# EAGLE design TranslatorETH (EAGLE 7.6.0)
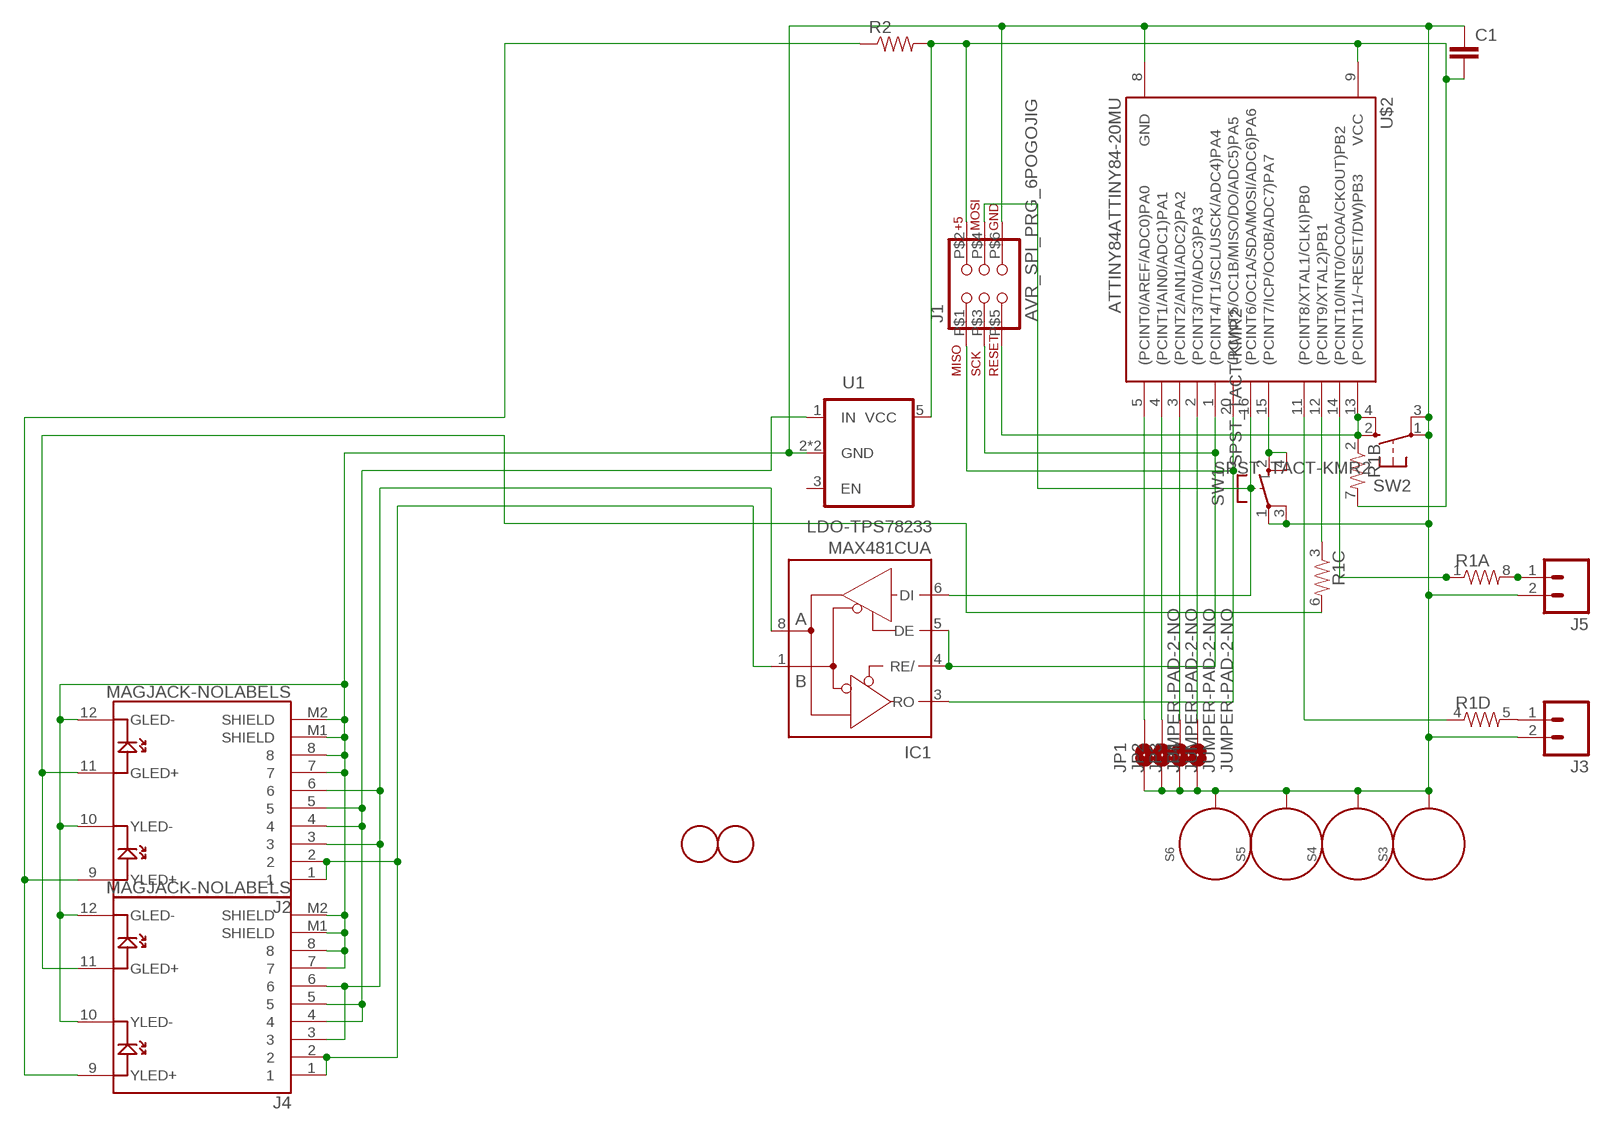
[diagram p0: schematic, sheet 1]

## Parts
C1  CAP0805  [0805]
IC1  MAX481CUA  [UMAX8]
J1  AVR_SPI_PRG_6POGOJIG  [2X3_MAX]
J2  MAGJACK-NOLABELS  [MAGJACK]
J3  M025MM  [SCREWTERMINAL-5MM-2]
J4  MAGJACK-NOLABELS  [MAGJACK]
J5  M025MM  [SCREWTERMINAL-5MM-2]
JP1  JUMPER-PAD-2-NO  [PAD-JUMPER-2-NO_NO_SILK]
JP2  JUMPER-PAD-2-NO  [PAD-JUMPER-2-NO_NO_SILK]
JP3  JUMPER-PAD-2-NO  [PAD-JUMPER-2-NO_NO_SILK]
JP4  JUMPER-PAD-2-NO  [PAD-JUMPER-2-NO_NO_SILK]
R1  RESISTOR-ARRAY0603-ARV  [0603-ARV]
R2  RESISTOR0805-RES  [0805]
S3  STANDOFF_ELECTRICAL  [STANDOFF-ELECTRICAL]
S4  STANDOFF_ELECTRICAL  [STANDOFF-ELECTRICAL]
S5  STANDOFF_ELECTRICAL  [STANDOFF-ELECTRICAL]
S6  STANDOFF_ELECTRICAL  [STANDOFF-ELECTRICAL]
SW1  SPST_TACT-KMR2  [KMR2]
SW2  SPST_TACT-KMR2  [KMR2]
U1  LDO-TPS78233  [SOT23-5]
U$2  ATTINY84ATTINY84-20MU  [QFN20]
U$3  FIDUCIAL  [FIDUCIAL_1MM]
U$4  FIDUCIAL  [FIDUCIAL_1MM]

## Nets
485A: IC1.8(A) J2.3 J2.6 J4.3 J4.6
485B: IC1.1(B) J2.1 J2.2 J4.1 J4.2
FLOW: IC1.4(RE/) IC1.5(DE) J1.P$3(SCK) U$2.1((PCINT4/T1/SCL/USCK/ADC4)PA4)
GND: C1.1 J1.P$6(GND) J2.7 J2.8 J2.10(YLED-) J2.12(GLED-) J2.M1(SHIELD) J2.M2(SHIELD) J3.2 J4.7 J4.8 J4.10(YLED-) J4.12(GLED-) J4.M1(SHIELD) J4.M2(SHIELD) J5.2 JP1.1 JP2.1 JP3.1 JP4.1 S3.P1 S4.P1 S5.P1 S6.P1 SW1.1(P) SW1.3(P1) SW2.1(P) SW2.3(P1) U1.2(GND) U1.4(GND) U$2.8(GND)
N$1: JP1.2 U$2.5((PCINT0/AREF/ADC0)PA0)
N$2: R1.3 U$2.12((PCINT9/XTAL2)PB1)
N$3: J3.1 R1.5
N$4: JP2.2 U$2.4((PCINT1/AIN0/ADC1)PA1)
N$5: J5.1 R1.8
N$6: JP3.2 U$2.3((PCINT2/AIN1/ADC2)PA2)
N$7: JP4.2 U$2.2((PCINT3/T0/ADC3)PA3)
N$9: SW1.2(S) SW1.4(S1) U$2.15((PCINT7/ICP/OC0B/ADC7)PA7)
N$13: J2.11(GLED+) J4.11(GLED+) R1.6
N$14: J2.9(YLED+) J4.9(YLED+) R2.1
N$15: J2.4 J2.5 J4.4 J4.5 U1.1(IN)
OUT1: R1.1 U$2.14((PCINT10/INT0/OC0A/CKOUT)PB2)
OUT3: R1.4 U$2.11((PCINT8/XTAL1/CLKI)PB0)
RST: J1.P$5(RESET) R1.2 SW2.2(S) SW2.4(S1) U$2.13((PCINT11/~RESET/DW)PB3)
RX: IC1.3(RO) J1.P$1(MISO) U$2.20((PCINT5/OC1B/MISO/DO/ADC5)PA5)
TX: IC1.6(DI) J1.P$4(MOSI) U$2.16((PCINT6/OC1A/SDA/MOSI/ADC6)PA6)
VCC: C1.2 J1.P$2(VIN) R1.7 R2.2 U1.5(VCC) U$2.9(VCC)
Unconnected: U1.3(EN)

## Power pins joined to a net without a drawn wire
GND: IC1.7(GND)
VCC: IC1.2(VCC)

## Library data of the parts
C1 = SparkFun-Capacitors:CAP: Capacitor Standard 0603 ceramic capacitor, and 0.1" leaded capacitor.
IC1 = maxim:MAX481CUA: RS485 TRANSEIVER; MPN: MAX481CUA+; OC_FARNELL: unknown; OC_NEWARK: 71P2381
J1 = SparkFun-Connectors:AVR_SPI_PRG_6: AVR ISP 6 Pin This is the reduced ISP connector for AVR programming. Common on Arduino. This footprint will take up less PCB space and can be used with a 10-pin to 6-pin adapter such as SKU: BOB-08508 **Special note about "TEST_POINT" package. The stop mask is on the top side, so if you want your programming test points to be on the bottom of your board, make sure to place this package on the bottom side of the board. This also ensure that the orientation to program from the bottom side will be correct.
J2 J4 = SparkFun-Connectors:MAGJACK-NOLABELS; PROD_ID: CONN-09556
J3 J5 = SparkFun-Connectors:M02: Standard 2-pin 0.1" header. Use with - straight break away headers ( PRT-00116) - right angle break away headers (PRT-00553) - swiss pins (PRT-00743) - machine pins (PRT-00117) - female headers (PRT-00115) Molex polarized connector foot print use with: PRT-08233 with associated crimp pins and housings. 2.54_SCREWTERM for use with PRT-10571. 3.5mm Screw Terminal footprints for PRT-08084 5mm Screw Terminal footprints for use with PRT-08432; STOREFRONT_ID: PRT-08432
JP1-JP4 = SparkFun-Passives:JUMPER-PAD-2-NO
R1 = SparkFun-Resistors:RESISTOR-ARRAY: Array Chip Resistor Source: RS Component / Phycomp
R2 = SparkFun-Resistors:RESISTOR: Resistor Basic schematic elements and footprints for 0603, 1206, and PTH resistors.
S3-S6 = SparkFun-Electromechanical:STANDOFF_ELECTRICAL: A standoff intended to be an electrically connected point. Pad size and stop size allow for a #4 Phillips pan screw head to make a solid connection to the board.
SW1 SW2 = adafruit:SPST_TACT: SMT 6mm switch, EVQQ2 series http://www.ladyada.net/library/eagle
U1 = SparkFun-PowerIC:LDO-TPS78233: Voltage Regulator LDO 500nA Ground Current, 150mA, Ultra-Low Quiescent Current Low-Dropout Linear Regulator.
U$2 = SparkFun-DigitalIC:ATTINY84: Atmel 14-pin 2/4/8kB flash uC
U$3 U$4 = adafruit:FIDUCIAL: For use by pick and place machines to calibrate the vision/machine, 1mm By microbuilder.eu

## Board
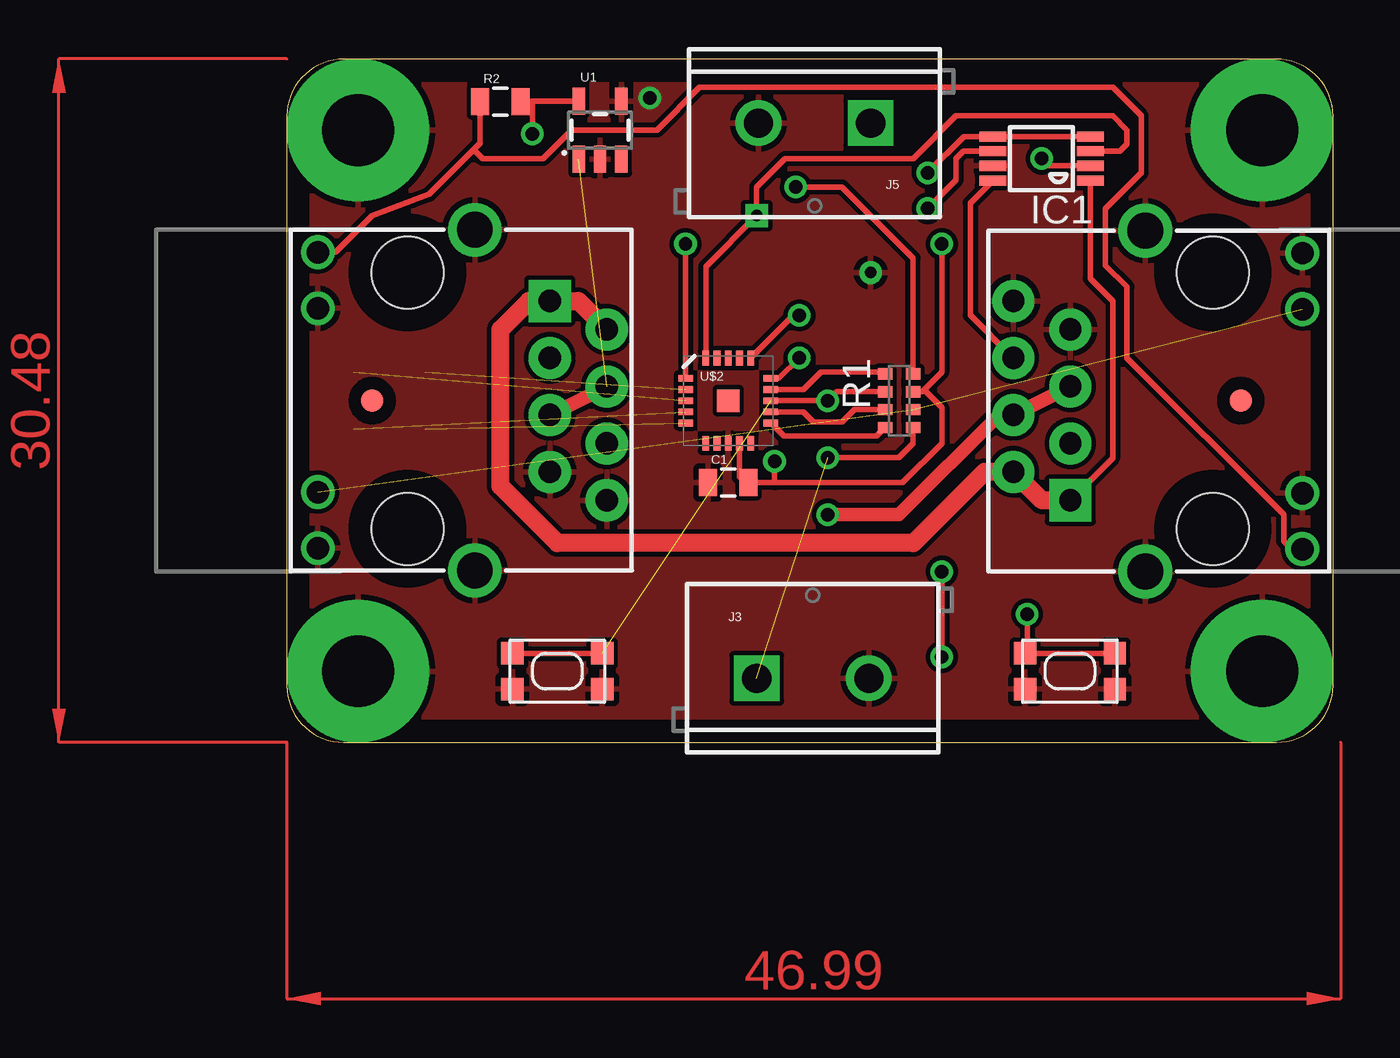
[diagram p1: board, top side]
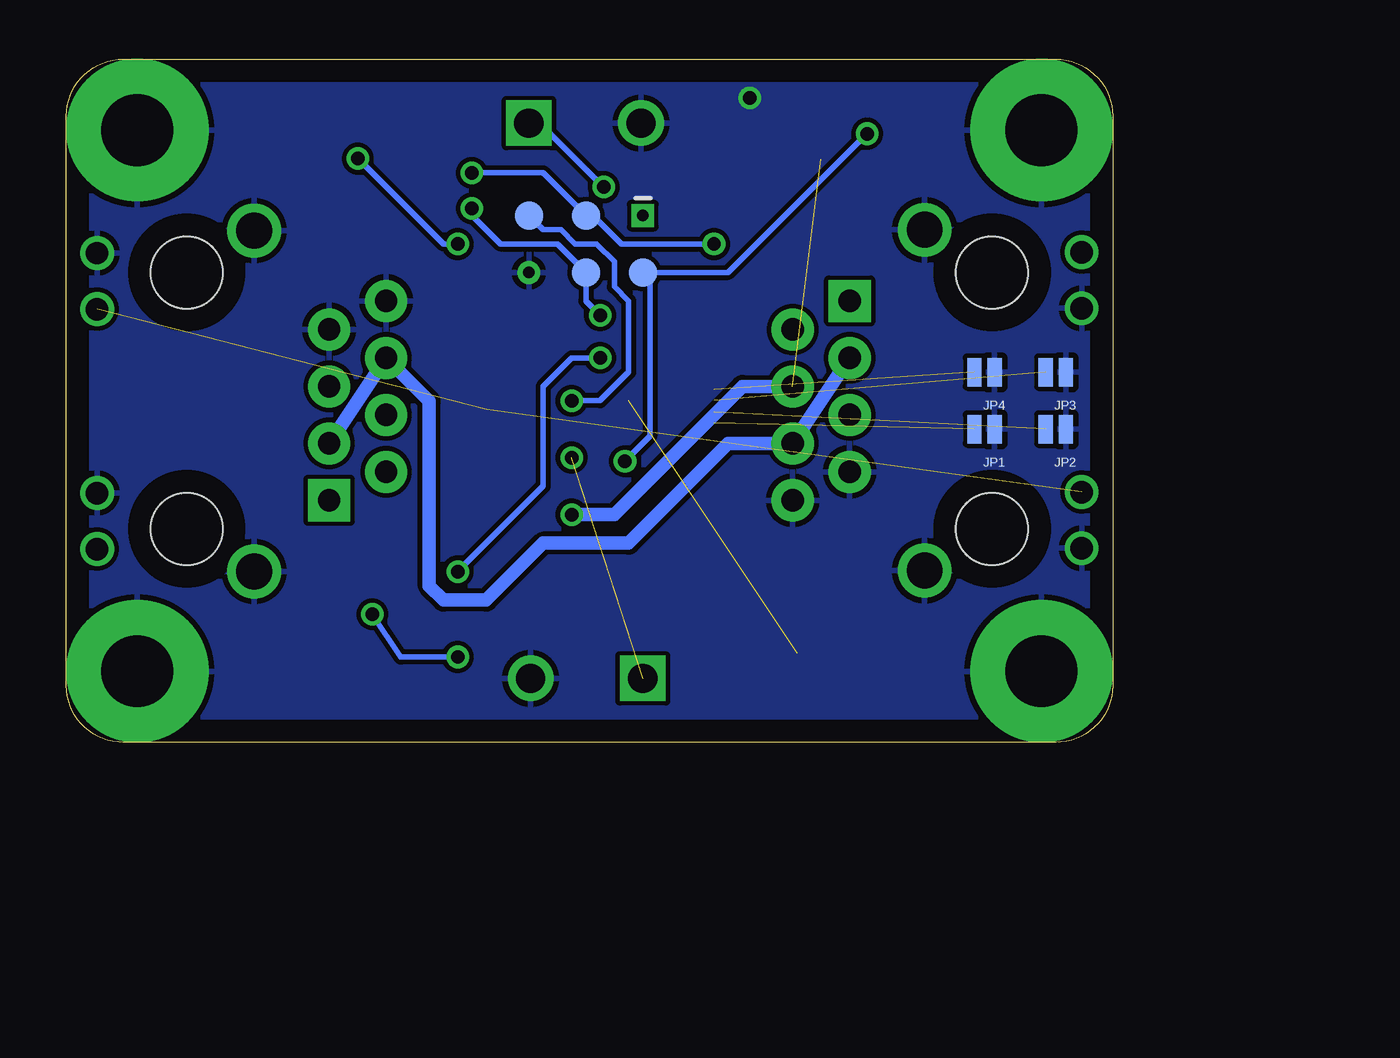
[diagram p2: board, bottom side, seen from below]

Size 46.66 x 30.47 mm. Coordinates in mm from the lower left corner, seen from the top.
Outline: 0,27.93 0,2.54 arc90 2.54,0 44.12,0 arc90 46.66,2.54 46.66,27.93 arc90 44.12,30.47 2.54,30.47 arc90 0,27.93
Copper layers (1*16): Top 0.035mm / dielectric 1.5mm / Bottom 0.035mm
Design rules "default": minimum track width 10mil, minimum drill 24mil, track to track 8mil, track to pad 8mil, pad to pad 8mil, via to via 8mil, smd to smd 8mil, copper to edge 40mil, drill to drill 8mil, minimum pad ring 10mil, minimum via ring 8mil, stop-mask expansion 4mil, vias tented up to drill 0mil, thermal gap 10mil

### Footprints (pad centres in the part's own frame; a part is rotated, then mirrored left to right if it is on the bottom)
0805 = smd 0.8 x 1.2: 1 -0.9,0; 2 0.9,0
UMAX8 = smd 0.45 x 1.2: 1 -0.975,-2.175; 2 -0.325,-2.175; 3 0.325,-2.175; 4 0.975,-2.175; 5 0.975,2.175; 6 0.325,2.175; 7 -0.325,2.175; 8 -0.975,2.175
2X3_MAX = drill 0.508 square: P$1 -2.54,-1.27 | smd 1.27 x 1.27: P$2 -2.54,1.27; P$3 0,-1.27; P$4 0,1.27; P$5 2.54,-1.27 | drill 0.508: P$6 2.54,1.27
MAGJACK = drill 1 pad 1.88 square: 1 3.175,17.445 | drill 1 pad 1.88: 2 4.445,19.985; 3 5.715,17.445; 4 6.985,19.985; 5 8.255,17.445; 6 9.525,19.985; 7 10.795,17.445; 8 12.065,19.985 | drill 1 pad 1.27: 9 1,7.1; 10 3.5,7.1; 11 11.7,7.1; 12 14.2,7.1 | drill 1.6 pad 2.184: M1 0,14.1; M2 15.2,14.1 | hole 3.2: 1.905,11.095; 13.335,11.095
SCREWTERMINAL-5MM-2 = drill 1.3 pad 2.032 square: 1 0,0 | drill 1.3 pad 2.032: 2 5,0
PAD-JUMPER-2-NO_NO_SILK = smd 0.635 x 1.27: 1 -0.45,0; 2 0.45,0
0603-ARV = smd 0.5 x 0.65: 1 -1.2,-0.625; 2 -0.4,-0.625; 3 0.4,-0.625; 4 1.2,-0.625; 5 1.2,0.625; 6 0.4,0.625; 7 -0.4,0.625; 8 -1.2,0.625
STANDOFF-ELECTRICAL = drill 3.2 pad 6.35: P1 0,0
KMR2 = smd 1 x 1: 1 2,0.8; 2 2,-0.8; 3 -2,0.8; 4 -2,-0.8
SOT23-5 = smd 0.55 x 1.2: 1 -0.95,-1.3; 2 0,-1.3; 3 0.95,-1.3; 4 0.95,1.3; 5 -0.95,1.3
QFN20 = smd 1 x 1: 0 0,0 | smd 0.65 x 0.3: 1 -1.9,1; 2 -1.9,0.5; 3 -1.9,0; 4 -1.9,-0.5; 5 -1.9,-1; 11 1.9,-1; 12 1.9,-0.5; 13 1.9,0; 14 1.9,0.5; 15 1.9,1 | smd 0.3 x 0.65: 6 -1,-1.9; 7 -0.5,-1.9; 8 0,-1.9; 9 0.5,-1.9; 10 1,-1.9; 16 1,1.9; 17 0.5,1.9; 18 0,1.9; 19 -0.5,1.9; 20 -1,1.9
FIDUCIAL_1MM = smd 1 x 1: 1 0,0

### Placement (x,y rotation side)
C1  19.68,11.59 0 top
IC1  33.66,26.04 90 top
J1  23.5,22.23 180 bottom
J2  52.39,7.62 90 top
J3  20.95,2.86 0 top
J4  -5.71,22.86 270 top
J5  26.04,27.62 180 top
JP1  5.71,13.97 180 bottom
JP2  2.54,13.97 180 bottom
JP3  2.54,16.51 180 bottom
JP4  5.71,16.51 180 bottom
R1  27.3,15.24 270 top
R2  9.53,28.57 0 top
S3  3.17,3.17 0 top
S4  3.17,27.3 0 top
S5  43.5,27.3 0 top
S6  43.5,3.17 0 top
SW1  34.92,3.17 180 top
SW2  12.06,3.17 180 top
U1  13.97,27.3 0 top
U$2  19.68,15.24 0 top
U$3  42.55,15.24 0 top
U$4  3.81,15.24 0 top

### Tracks (layer width: path | path; a pad name or v marks a point on that pad's centre or on a via)
485A
  Top 0.254: IC1.8 30.48,24.06 30.48,19.05 32.38,17.14 J2.6
  Bottom 0.61: J2.3 J2.6 30.48,15.22 30.48,6.99 29.84,6.35 27.94,6.35 25.4,8.89 21.59,8.89 17.14,13.34 J4.6 J4.3
485B
  Top 0.254: IC1.1 35.83,20.68 36.83,19.68 36.83,12.68 J2.1
  Top 0.813: J4.2 13,19.68 J4.1 10.79,19.68 9.53,18.41 9.53,11.43 12.06,8.89 27.94,8.89 31.11,12.06 J2.2 33.67,10.79 J2.1
FLOW  (via drill 0.6)
  Top 0.254: IC1.4 IC1.5 30.18,27.01 v28.57,25.4 | v17.78,22.23 U$2.1
  Bottom 0.254: v28.57,25.4 25.4,25.4 J1.P$3 23.18,23.5 21.91,22.23 v17.78,22.23
GND  (via drill 0.6)
  other vias: 16.19,28.73
  pour Top: -0.64,31.11 47.62,31.11 47.62,-1.27 -0.64,-1.27
  pour Bottom: -0.64,31.11 47.62,31.11 47.62,-1.27 -0.64,-1.27
N$1  (1 unrouted)
N$2
  Top 0.254: U$2.12 23.04,14.74 23.5,14.29 24.77,14.29 25.32,14.84 R1.3
N$3  (via drill 0.6)  (1 unrouted)
  Top 0.254: v24.13,12.7 27.3,12.7 27.93,13.32 R1.5
N$4  (1 unrouted)
N$5  (via drill 0.6)
  Top 0.254: R1.8 27.93,21.6 24.77,24.77 v22.7,24.77
  Bottom 0.254: v22.7,24.77 25.56,27.62 J5.1
N$6  (1 unrouted)
N$7  (1 unrouted)
N$9  (via drill 0.6)
  Top 0.254: SW1.4 SW1.2 33.02,4.07 v33.02,5.71 | U$2.15 21.95,16.24 v22.86,17.14 | v29.21,7.62 v29.21,3.81
  Bottom 0.254: v22.86,17.14 24.13,17.14 25.4,15.88 25.4,11.43 v29.21,7.62 | v29.21,3.81 31.75,3.81 v33.02,5.71
N$13  (2 unrouted)
N$14
  Top 0.254: J4.9 2.17,21.86 3.81,23.5 6.35,24.45 8.33,26.43 | 8.33,26.43 8.62,26.72 R2.1 | J2.9 44.81,8.62 44.45,8.98 44.45,10.16 37.47,17.14 37.47,20.32 36.51,21.27 36.51,23.81 38.1,25.4 38.1,27.94 36.83,29.21 18.41,29.21 16.51,27.3 12.7,27.3 11.43,26.04 8.73,26.04 8.33,26.43
N$15  (via drill 0.6)  (1 unrouted)
  Top 0.61: J2.5 J2.4 31.75,14.61 27.3,10.16 v24.13,10.16 | J4.5 J4.4
  Bottom 0.61: v24.13,10.16 22.23,10.16 16.51,15.88 J4.4
OUT1
  Top 0.254: U$2.14 23.04,15.74 23.81,16.51 26.61,16.51 R1.1
OUT3
  Top 0.254: U$2.11 22.17,13.65 26.29,13.65 R1.4
RST  (via drill 0.6)  (1 unrouted)
  Top 0.254: SW2.2 SW2.4 | U$2.13 v24.13,15.24 24.53,15.64 R1.2
  Bottom 0.254: J1.P$5 25.4,22.86 24.61,22.86 23.97,22.23 23.02,22.23 22.23,21.43 22.23,20.32 21.59,19.68 21.59,16.51 22.86,15.24 v24.13,15.24
RX
  Top 0.254: U$2.20 18.68,21.23 J1.P$1 20.95,24.77 22.23,26.04 27.94,26.04 29.84,27.94 36.83,27.94 37.47,27.3 37.47,26.67 37.16,26.36 IC1.3
TX  (via drill 0.6)
  Top 0.254: IC1.6 30.17,26.36 29.84,26.04 29.84,25.08 v28.57,23.81 | v22.86,19.05 22.59,19.05 U$2.16
  Bottom 0.254: v28.57,23.81 28.57,23.5 27.3,22.23 24.77,22.23 J1.P$4 23.5,19.68 v22.86,19.05
VCC  (via drill 0.6)
  Top 0.254: R2.2 10.46,28.61 10.95,28.61 | 10.95,28.61 U1.5 | U$2.9 20.18,11.83 C1.2 21.75,11.59 | IC1.2 33.66,25.72 v33.66,26.04 | v29.21,22.23 29.21,16.51 28.34,15.64 R1.7 28.49,15.64 29.21,14.92 29.21,13.34 27.46,11.59 21.75,11.59 | v10.95,27.15 10.95,28.61 | v21.75,12.54 21.75,11.59
  Bottom 0.254: v33.66,26.04 29.84,22.23 v29.21,22.23 | v10.95,27.15 17.14,20.95 J1.P$2 20.64,20.64 20.64,13.65 v21.75,12.54
(copper drawn outside any net)
  shapes: Top area x2